# EAGLE design ME433 (EAGLE 9.6.2)
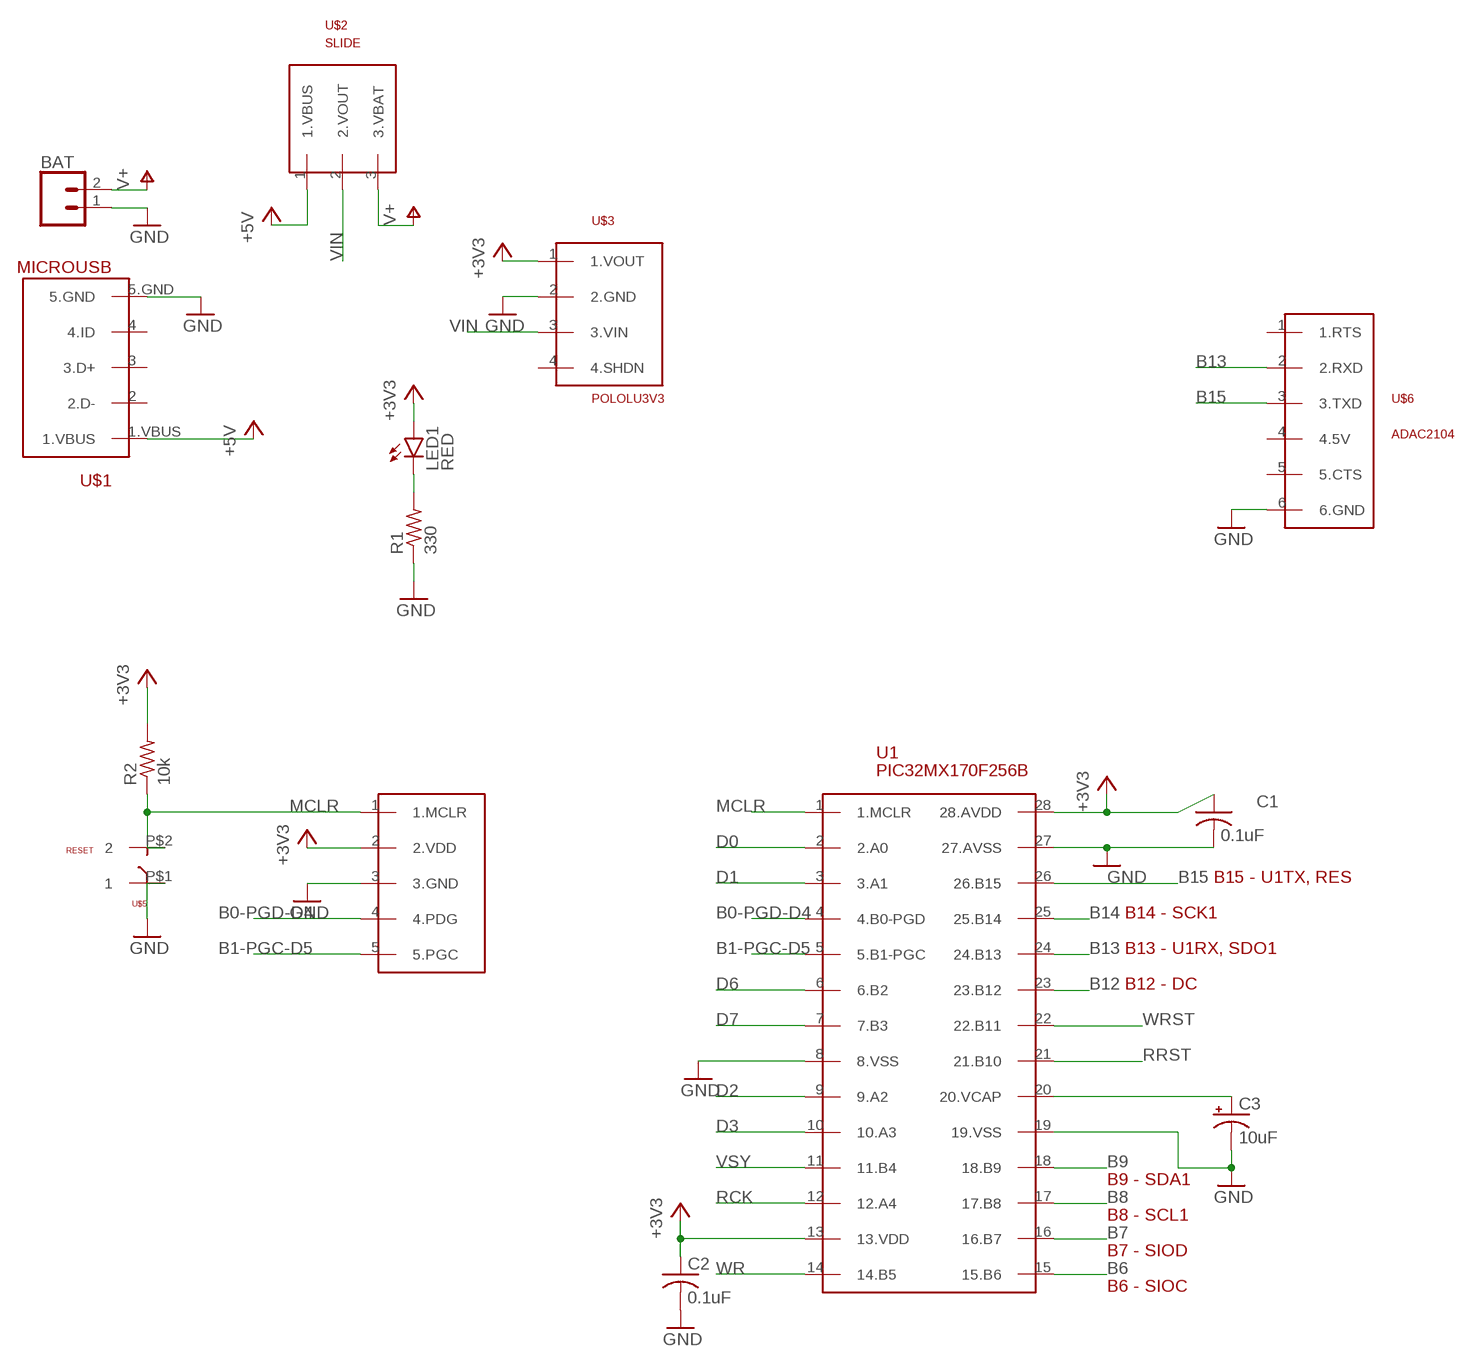
[diagram p0: schematic, sheet 1, part 1 of 2]
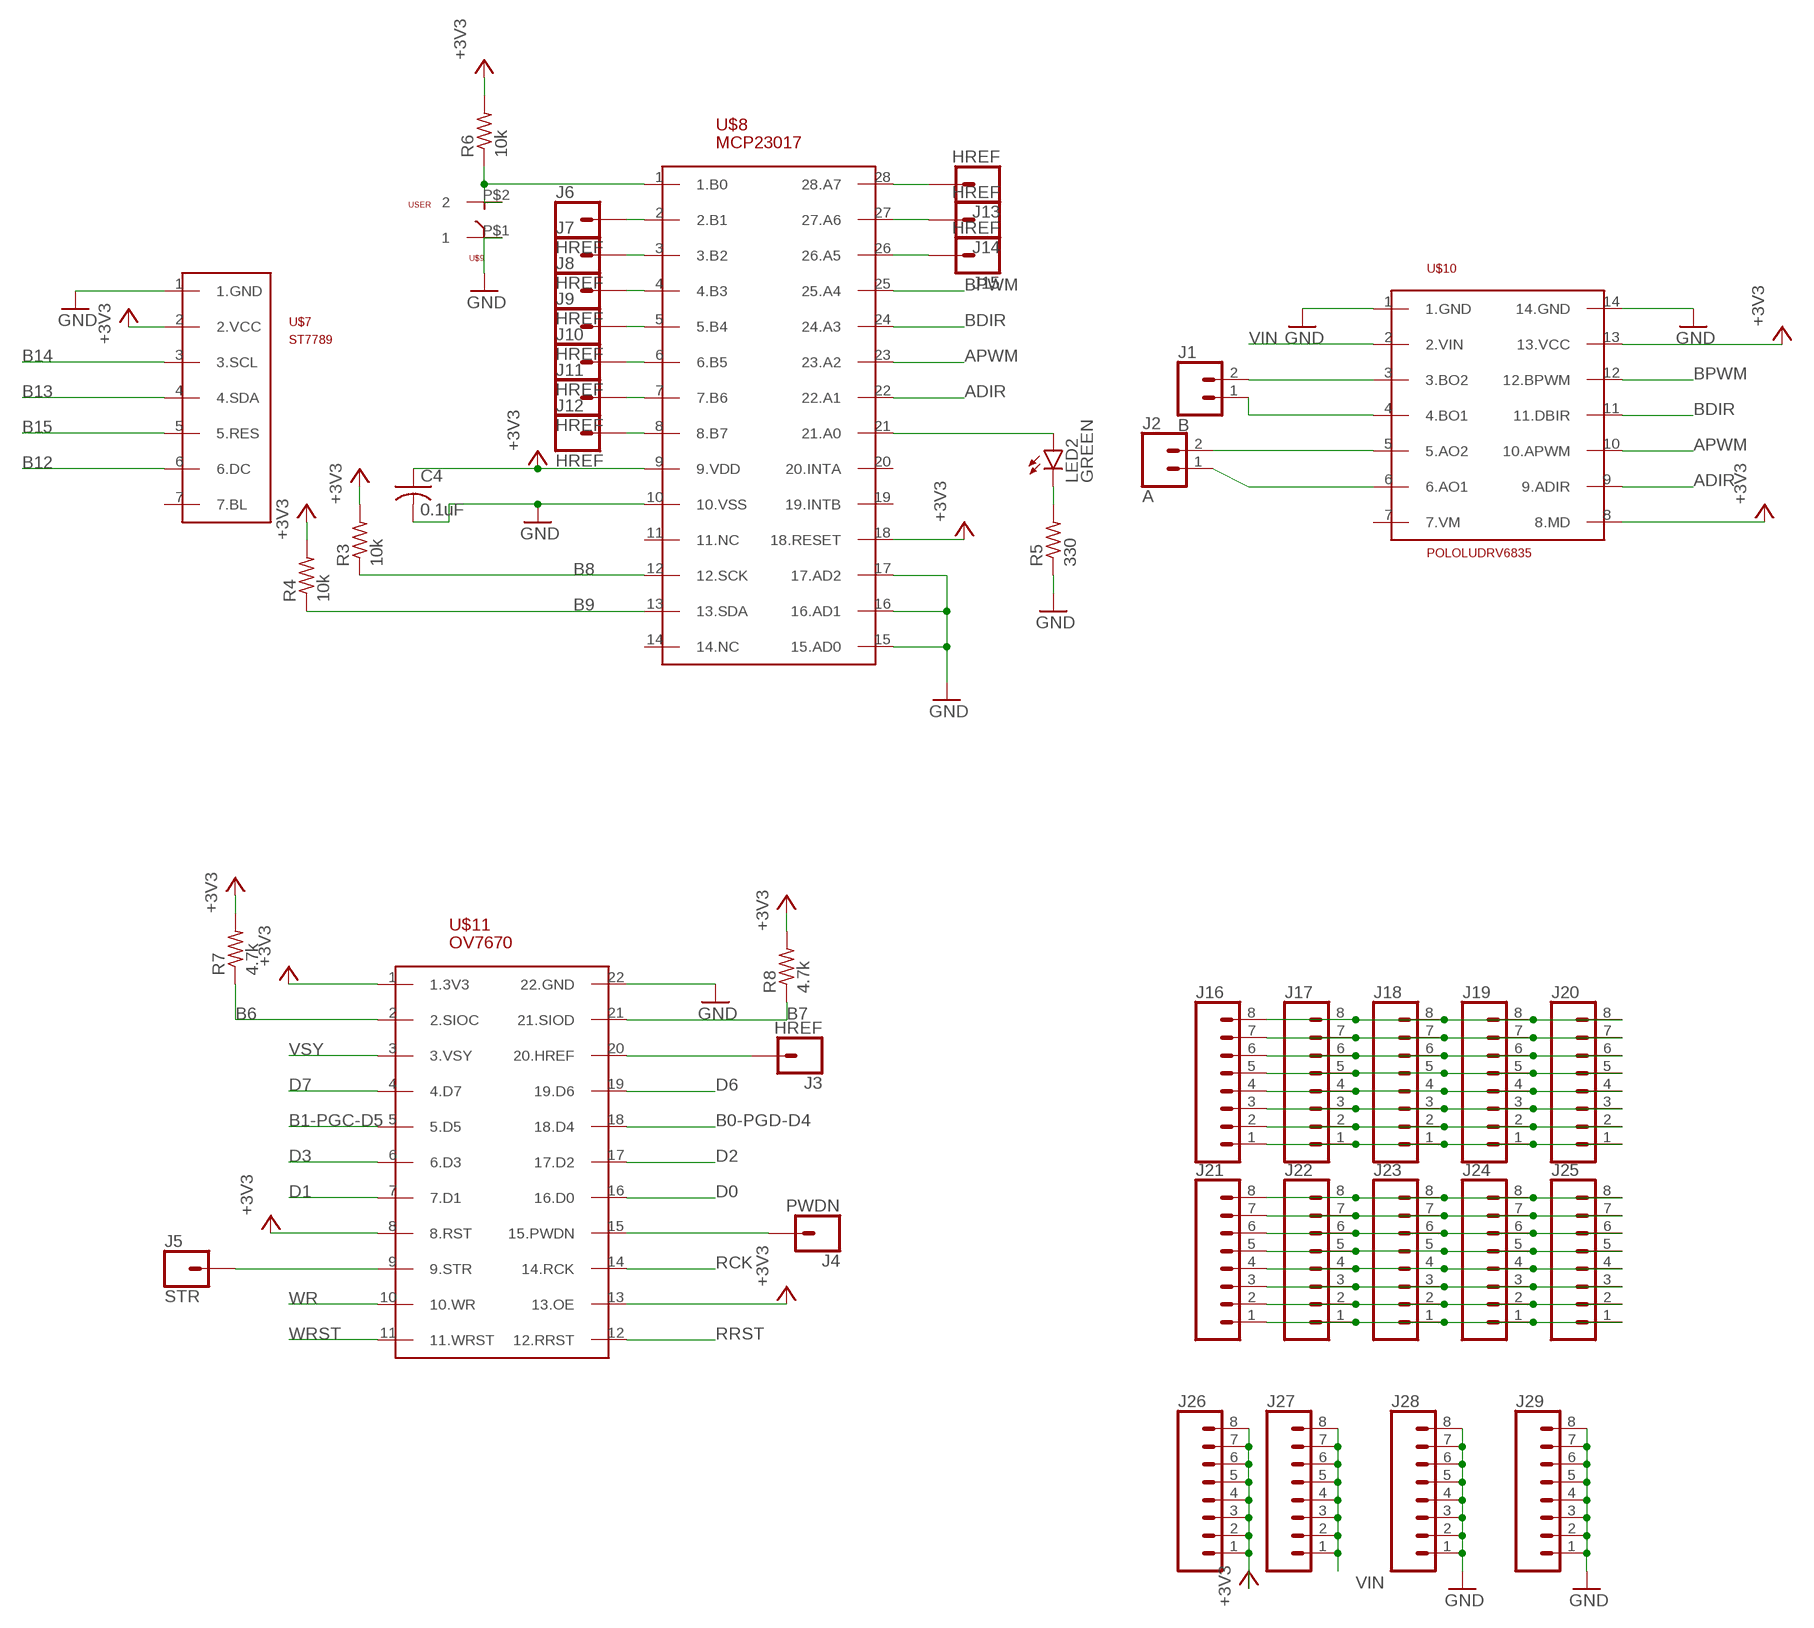
[diagram p1: schematic, sheet 1, part 2 of 2]

## Parts
BAT  CONN_02  [1X02]
C1  0.1uF  C-US025-030X050  [C025-030X050]
C2  0.1uF  C-US025-030X050  [C025-030X050]
C3  10uF  CPOL-USB45181B  [B45181B]
C4  0.1uF  C-US025-030X050  [C025-030X050]
J1  B  CONN_02  [1X02]
J2  A  CONN_02  [1X02]
J3  HREF  CONN_01  [1X01]
J4  PWDN  CONN_01  [1X01]
J5  STR  CONN_01  [1X01]
J6  HREF  CONN_01  [1X01]
J7  HREF  CONN_01  [1X01]
J8  HREF  CONN_01  [1X01]
J9  HREF  CONN_01  [1X01]
J10  HREF  CONN_01  [1X01]
J11  HREF  CONN_01  [1X01]
J12  HREF  CONN_01  [1X01]
J13  HREF  CONN_01  [1X01]
J14  HREF  CONN_01  [1X01]
J15  HREF  CONN_01  [1X01]
J16  CONN_08"  [1X08]
J17  CONN_08"  [1X08]
J18  CONN_08"  [1X08]
J19  CONN_08"  [1X08]
J20  CONN_08"  [1X08]
J21  CONN_08"  [1X08]
J22  CONN_08"  [1X08]
J23  CONN_08"  [1X08]
J24  CONN_08"  [1X08]
J25  CONN_08"  [1X08]
J26  CONN_08"  [1X08]
J27  CONN_08"  [1X08]
J28  CONN_08"  [1X08]
J29  CONN_08"  [1X08]
LED1  RED  LED3MM  [LED3MM]
LED2  GREEN  LED3MM  [LED3MM]
R1  330  R-US_0207/10  [0207/10]
R2  10k  R-US_0207/10  [0207/10]
R3  10k  R-US_0207/10  [0207/10]
R4  10k  R-US_0207/10  [0207/10]
R5  330  R-US_0207/10  [0207/10]
R6  10k  R-US_0207/10  [0207/10]
R7  4.7k  R-US_0207/10  [0207/10]
R8  4.7k  R-US_0207/10  [0207/10]
U1  PIC32MX170F256B  [DIL28-3]
U$1  MICROUSB  [MICROUSB]
U$2  SLIDE  [SLIDE]
U$3  POLOLU3V3  [POLOLU3V3]
U$4  SNAP  [SNAP]
U$5  RESET  PUSH  [PUSH]
U$6  ADAC2104  [ADAC2104]
U$7  ST7789  [ST7789]
U$8  MCP23017  [DIL28-3]
U$9  USER  PUSH  [PUSH]
U$10  POLOLUDRV6835  [POLOLUDRV6835]
U$11  OV7670  [OV7670]

## Nets
+3V3: C1.1 C2.1 C4.1 J26.1 J26.2 J26.3 J26.4 J26.5 J26.6 J26.7 J26.8 LED1.A R2.2 R3.2 R4.2 R6.2 R7.2 R8.2 U1.13(13.VDD) U1.28(28.AVDD) U$3.1(1.VOUT) U$4.2(2.VDD) U$7.2(2.VCC) U$8.9(9.VDD) U$8.18(18.RESET) U$10.8(8.MD) U$10.13(13.VCC) U$11.1(1.3V3) U$11.8(8.RST) U$11.13(13.OE)
+5V: U$1.1.VBUS U$2.1(1.VBUS)
ADIR: U$8.22(22.A1) U$10.9(9.ADIR)
APWM: U$8.23(23.A2) U$10.10(10.APWM)
B0-PGD-D4: U1.4(4.B0-PGD) U$4.4(4.PDG) U$11.18(18.D4)
B1-PGC-D5: U1.5(5.B1-PGC) U$4.5(5.PGC) U$11.5(5.D5)
B6: R7.1 U1.15(15.B6) U$11.2(2.SIOC)
B7: R8.1 U1.16(16.B7) U$11.21(21.SIOD)
B8: R3.1 U1.17(17.B8) U$8.12(12.SCK)
B9: R4.1 U1.18(18.B9) U$8.13(13.SDA)
B12: U1.23(23.B12) U$7.6(6.DC)
B13: U1.24(24.B13) U$6.2(2.RXD) U$7.4(4.SDA)
B14: U1.25(25.B14) U$7.3(3.SCL)
B15: U1.26(26.B15) U$6.3(3.TXD) U$7.5(5.RES)
BDIR: U$8.24(24.A3) U$10.11(11.DBIR)
BPWM: U$8.25(25.A4) U$10.12(12.BPWM)
D0: U1.2(2.A0) U$11.16(16.D0)
D1: U1.3(3.A1) U$11.7(7.D1)
D2: U1.9(9.A2) U$11.17(17.D2)
D3: U1.10(10.A3) U$11.6(6.D3)
D6: U1.6(6.B2) U$11.19(19.D6)
D7: U1.7(7.B3) U$11.4(4.D7)
GND: BAT.1 C1.2 C2.2 C3.- C4.2 J28.1 J28.2 J28.3 J28.4 J28.5 J28.6 J28.7 J28.8 J29.1 J29.2 J29.3 J29.4 J29.5 J29.6 J29.7 J29.8 R1.1 R5.1 U1.8(8.VSS) U1.19(19.VSS) U1.27(27.AVSS) U$1.5.GND U$3.2(2.GND) U$4.3(3.GND) U$5.P$1 U$6.6(6.GND) U$7.1(1.GND) U$8.10(10.VSS) U$8.15(15.AD0) U$8.16(16.AD1) U$8.17(17.AD2) U$9.P$1 U$10.1(1.GND) U$10.14(14.GND) U$11.22(22.GND)
MCLR: R2.1 U1.1(1.MCLR) U$4.1(1.MCLR) U$5.P$2
N$1: LED1.K(C) R1.2
N$2: C3.+ U1.20(20.VCAP)
N$3: LED2.K(C) R5.2
N$4: J1.2 U$10.3(3.BO2)
N$5: J1.1 U$10.4(4.BO1)
N$6: LED2.A U$8.21(21.A0)
N$7: R6.1 U$8.1(1.B0) U$9.P$2
N$8: J2.2 U$10.5(5.AO2)
N$9: J2.1 U$10.6(6.AO1)
N$10: J5.1 U$11.9(9.STR)
N$11: J4.1 U$11.15(15.PWDN)
N$12: J3.1 U$11.20(20.HREF)
N$13: J6.1 U$8.2(2.B1)
N$14: J7.1 U$8.3(3.B2)
N$15: J8.1 U$8.4(4.B3)
N$16: J9.1 U$8.5(5.B4)
N$17: J10.1 U$8.6(6.B5)
N$18: J11.1 U$8.7(7.B6)
N$19: J12.1 U$8.8(8.B7)
N$20: J13.1 U$8.28(28.A7)
N$21: J14.1 U$8.27(27.A6)
N$22: J15.1 U$8.26(26.A5)
N$23: J16.8 J17.8 J18.8 J19.8 J20.8
N$24: J16.7 J17.7 J18.7 J19.7 J20.7
N$25: J16.6 J17.6 J18.6 J19.6 J20.6
N$26: J16.5 J17.5 J18.5 J19.5 J20.5
N$27: J16.4 J17.4 J18.4 J19.4 J20.4
N$28: J16.3 J17.3 J18.3 J19.3 J20.3
N$29: J16.2 J17.2 J18.2 J19.2 J20.2
N$30: J16.1 J17.1 J18.1 J19.1 J20.1
N$31: J21.8 J22.8 J23.8 J24.8 J25.8
N$32: J21.7 J22.7 J23.7 J24.7 J25.7
N$33: J21.6 J22.6 J23.6 J24.6 J25.6
N$34: J21.5 J22.5 J23.5 J24.5 J25.5
N$35: J21.4 J22.4 J23.4 J24.4 J25.4
N$36: J21.3 J22.3 J23.3 J24.3 J25.3
N$37: J21.2 J22.2 J23.2 J24.2 J25.2
N$38: J21.1 J22.1 J23.1 J24.1 J25.1
RCK: U1.12(12.A4) U$11.14(14.RCK)
RRST: U1.21(21.B10) U$11.12(12.RRST)
V+: BAT.2 U$2.3(3.VBAT)
VIN: J27.1 J27.2 J27.3 J27.4 J27.5 J27.6 J27.7 J27.8 U$2.2(2.VOUT) U$3.3(3.VIN) U$10.2(2.VIN)
VSY: U1.11(11.B4) U$11.3(3.VSY)
WR: U1.14(14.B5) U$11.10(10.WR)
WRST: U1.22(22.B11) U$11.11(11.WRST)
Unconnected: U$1.2(2.D-) U$1.3(3.D+) U$1.4(4.ID) U$3.4(4.SHDN) U$6.1(1.RTS) U$6.4(4.5V) U$6.5(5.CTS) U$7.7(7.BL) U$8.11(11.NC) U$8.14(14.NC) U$8.19(19.INTB) U$8.20(20.INTA) U$10.7(7.VM)

## Notes on the sheet
- B15 - U1TX, RES
- B14 - SCK1
- B13 - U1RX, SDO1
- B12 - DC
- B9 - SDA1
- B8 - SCL1
- B7 - SIOD
- B6 - SIOC

## Library data of the parts
BAT J1 J2 = ME433:CONN_02: Multi connection point. Often used as Generic Header-pin footprint for 0.1 inch spaced/style header connections On any of the 0.1 inch spaced packages, you can populate with these: Break Away Headers - Straight <https://www.sparkfun.com/products/116> (PRT-00116) Break Away Male Headers - Right Angle <https://www.sparkfun.com/products/553> (PRT-00553) Female Headers <https://www.sparkfun.com/products/115> (PRT-00115) Break Away Headers - Machine Pin <https://www.sparkfun.com/products/117> (PRT-00117) Break Away Female Headers - Swiss Machine Pin <https://www.sparkfun.com/products/743> (PRT-00743) For SCREWTERMINALS and SPRING TERMINALS visit here: Screw Terimnals on SparkFun.com <https://www.sparkfun.com/search/results?term=Screw+Terminals> (5mm/3.5mm/2.54mm spacing) This device is also useful as a general connection point to wire up your design to another part of your project. Our various solder wires solder well into these plated through hole pads. Hook-Up Wire - Assortment (Stranded, 22 AWG) <https://www.sparkfun.com/products/11375> (PRT-11375) Hook-Up Wire - Assortment (Solid Core, 22 AWG) <https://www.sparkfun.com/products/11367> (PRT-11367) View the entire wire category on our website here <https://www.sparkfun.com/categories/141> Special notes: Molex polarized connector foot print use with: PRT-08233 with associated crimp pins and housings. 2.54_SCREWTERM for use with PRT-10571. 3.5mm Screw Terminal footprints for PRT-08084 5mm Screw Terminal footprints for use with PRT-08432
C1 C2 C4 = ME433:C-US: CAPACITOR, American symbol; SPICEPREFIX: C
C3 = ME433:CPOL-US: POLARIZED CAPACITOR, American symbol; SPICEPREFIX: C
J3-J15 = ME433:CONN_01: Single connection point. Often used as Generic Header-pin footprint for 0.1 inch spaced/style header connections On any of the 0.1 inch spaced packages, you can populate with these: Break Away Headers - Straight <https://www.sparkfun.com/products/116> (PRT-00116) Break Away Male Headers - Right Angle <https://www.sparkfun.com/products/553> (PRT-00553) Female Headers <https://www.sparkfun.com/products/115> (PRT-00115) Break Away Headers - Machine Pin <https://www.sparkfun.com/products/117> (PRT-00117) Break Away Female Headers - Swiss Machine Pin <https://www.sparkfun.com/products/743> (PRT-00743) This device is also useful as a general connection point to wire up your design to another part of your project. Our various solder wires solder well into these plated through hole pads. Hook-Up Wire - Assortment (Stranded, 22 AWG) <https://www.sparkfun.com/products/11375> (PRT-11375) Hook-Up Wire - Assortment (Solid Core, 22 AWG) <https://www.sparkfun.com/products/11367> (PRT-11367) View the entire wire category on our website here <https://www.sparkfun.com/categories/141> Special notes: SMTSO-256-ET is a "flush mount" nut for a 4-40 screw. We mostly use this on specialty testbeds; it is a nice way to connect hardware to your PCB at an adjustable hieght. Also note, the SNAP packages are for using a snappable style connector. We sell a baggie of snaps and they are also used on two LilyPad designs: Snap Assortment - 30 pack (male and female) <https://www.sparkfun.com/products/11347> (DEV-11347) LilyPad Arduino SimpleSnap <https://www.sparkfun.com/products/10941> (DEV-10941) LilyPad SimpleSnap Protoboard <https://www.sparkfun.com/products/10940> (DEV-10940)
J16-J29 = ME433:CONN_08: Multi connection point. Often used as Generic Header-pin footprint for 0.1 inch spaced/style header connections On any of the 0.1 inch spaced packages, you can populate with these: Break Away Headers - Straight <https://www.sparkfun.com/products/116> (PRT-00116) Break Away Male Headers - Right Angle <https://www.sparkfun.com/products/553> (PRT-00553) Female Headers <https://www.sparkfun.com/products/115> (PRT-00115) Break Away Headers - Machine Pin <https://www.sparkfun.com/products/117> (PRT-00117) Break Away Female Headers - Swiss Machine Pin <https://www.sparkfun.com/products/743> (PRT-00743) Arduino Stackable Header - 8 Pin <https://www.sparkfun.com/products/9279> (PRT-09279) For SCREWTERMINALS and SPRING TERMINALS visit here: Screw Terimnals on SparkFun.com <https://www.sparkfun.com/search/results?term=Screw+Terminals> (5mm/3.5mm/2.54mm spacing) This device is also useful as a general connection point to wire up your design to another part of your project. Our various solder wires solder well into these plated through hole pads. Hook-Up Wire - Assortment (Stranded, 22 AWG) <https://www.sparkfun.com/products/11375> (PRT-11375) Hook-Up Wire - Assortment (Solid Core, 22 AWG) <https://www.sparkfun.com/products/11367> (PRT-11367) View the entire wire category on our website here <https://www.sparkfun.com/categories/141> Special notes: Molex polarized connector foot print use with SKU : PRT-08231 with associated crimp pins and housings. 1MM SMD Version SKU: PRT-10208 NOTES ON THE VARIANTS LOCK and LOCK_LONGPADS... This footprint was designed to help hold the alignment of a through-hole component (i.e. 6-pin header) while soldering it into place. You may notice that each hole has been shifted either up or down by 0.005 of an inch from it's more standard position (which is a perfectly straight line). This slight alteration caused the pins (the squares in the middle) to touch the edges of the holes. Because they are alternating, it causes a "brace" to hold the component in place. 0.005 has proven to be the perfect amount of "off-center" position when using our standard breakaway headers. Although looks a little odd when you look at the bare footprint, once you have a header in there, the alteration is very hard to notice. Also,if you push a header all the way into place, it is covered up entirely on the bottom side.; PROD_ID: CONN-08438
LED1 LED2 = ME433:LED: LED OSRAM: - CHIPLED LG R971, LG N971, LY N971, LG Q971, LY Q971, LO R971, LY R971 LH N974, LH R974 LS Q976, LO Q976, LY Q976 LO Q996 - Hyper CHIPLED LW Q18S LB Q993, LB Q99A, LB R99A - SideLED LS A670, LO A670, LY A670, LG A670, LP A670 LB A673, LV A673, LT A673, LW A673 LH A674 LY A675 LS A676, LA A676, LO A676, LY A676, LW A676 LS A679, LY A679, LG A679 - Hyper Micro SIDELED® LS Y876, LA Y876, LO Y876, LY Y876 LT Y87S - SmartLED LW L88C, LW L88S LB L89C, LB L89S, LG L890 LS L89K, LO L89K, LY L89K LS L896, LA L896, LO L896, LY L896 - TOPLED LS T670, LO T670, LY T670, LG T670, LP T670 LSG T670, LSP T670, LSY T670, LOP T670, LYG T670 LG T671, LOG T671, LSG T671 LB T673, LV T673, LT T673, LW T673 LH T674 LS T676, LA T676, LO T676, LY T676, LB T676, LH T676, LSB T676, LW T676 LB T67C, LV T67C, LT T67C, LS T67K, LO T67K, LY T67K, LW E67C LS E67B, LA E67B, LO E67B, LY E67B, LB E67C, LV E67C, LT E67C LW T67C LS T679, LY T679, LG T679 LS T770, LO T770, LY T770, LG T770, LP T770 LB T773, LV T773, LT T773, LW T773 LH T774 LS E675, LA E675, LY E675, LS T675 LS T776, LA T776, LO T776, LY T776, LB T776 LHGB T686 LT T68C, LB T68C - Hyper Mini TOPLED® LB M676 - Mini TOPLED Santana® LG M470 LS M47K, LO M47K, LY M47K Source: http://www.osram.convergy.de LUXEON: - LUMILED® LXK2-PW12-R00, LXK2-PW12-S00, LXK2-PW14-U00, LXK2-PW14-V00 LXK2-PM12-R00, LXK2-PM12-S00, LXK2-PM14-U00 LXK2-PE12-Q00, LXK2-PE12-R00, LXK2-PE12-S00, LXK2-PE14-T00, LXK2-PE14-U00 LXK2-PB12-K00, LXK2-PB12-L00, LXK2-PB12-M00, LXK2-PB14-N00, LXK2-PB14-P00, LXK2-PB14-Q00 LXK2-PR12-L00, LXK2-PR12-M00, LXK2-PR14-Q00, LXK2-PR14-R00 LXK2-PD12-Q00, LXK2-PD12-R00, LXK2-PD12-S00 LXK2-PH12-R00, LXK2-PH12-S00 LXK2-PL12-P00, LXK2-PL12-Q00, LXK2-PL12-R00 Source: www.luxeon.com KINGBRIGHT: KA-3528ASYC Source: www.kingbright.com
R1-R8 = ME433:R-US_: RESISTOR, American symbol; SPICEPREFIX: R
U1 = ME433_HW6:PIC32MX170F256B
U$1 = ME433:MICROUSB
U$2 = ME433:SLIDE
U$3 = ME433:POLOLU3V3
U$4 = ME433:SNAP
U$5 U$9 = ME433:PUSH
U$6 = ME433:ADAC2104
U$7 = ME433:ST7789
U$8 = ME433:MCP23017
U$10 = ME433:POLOLUDRV6835
U$11 = ME433:OV7670

## Board
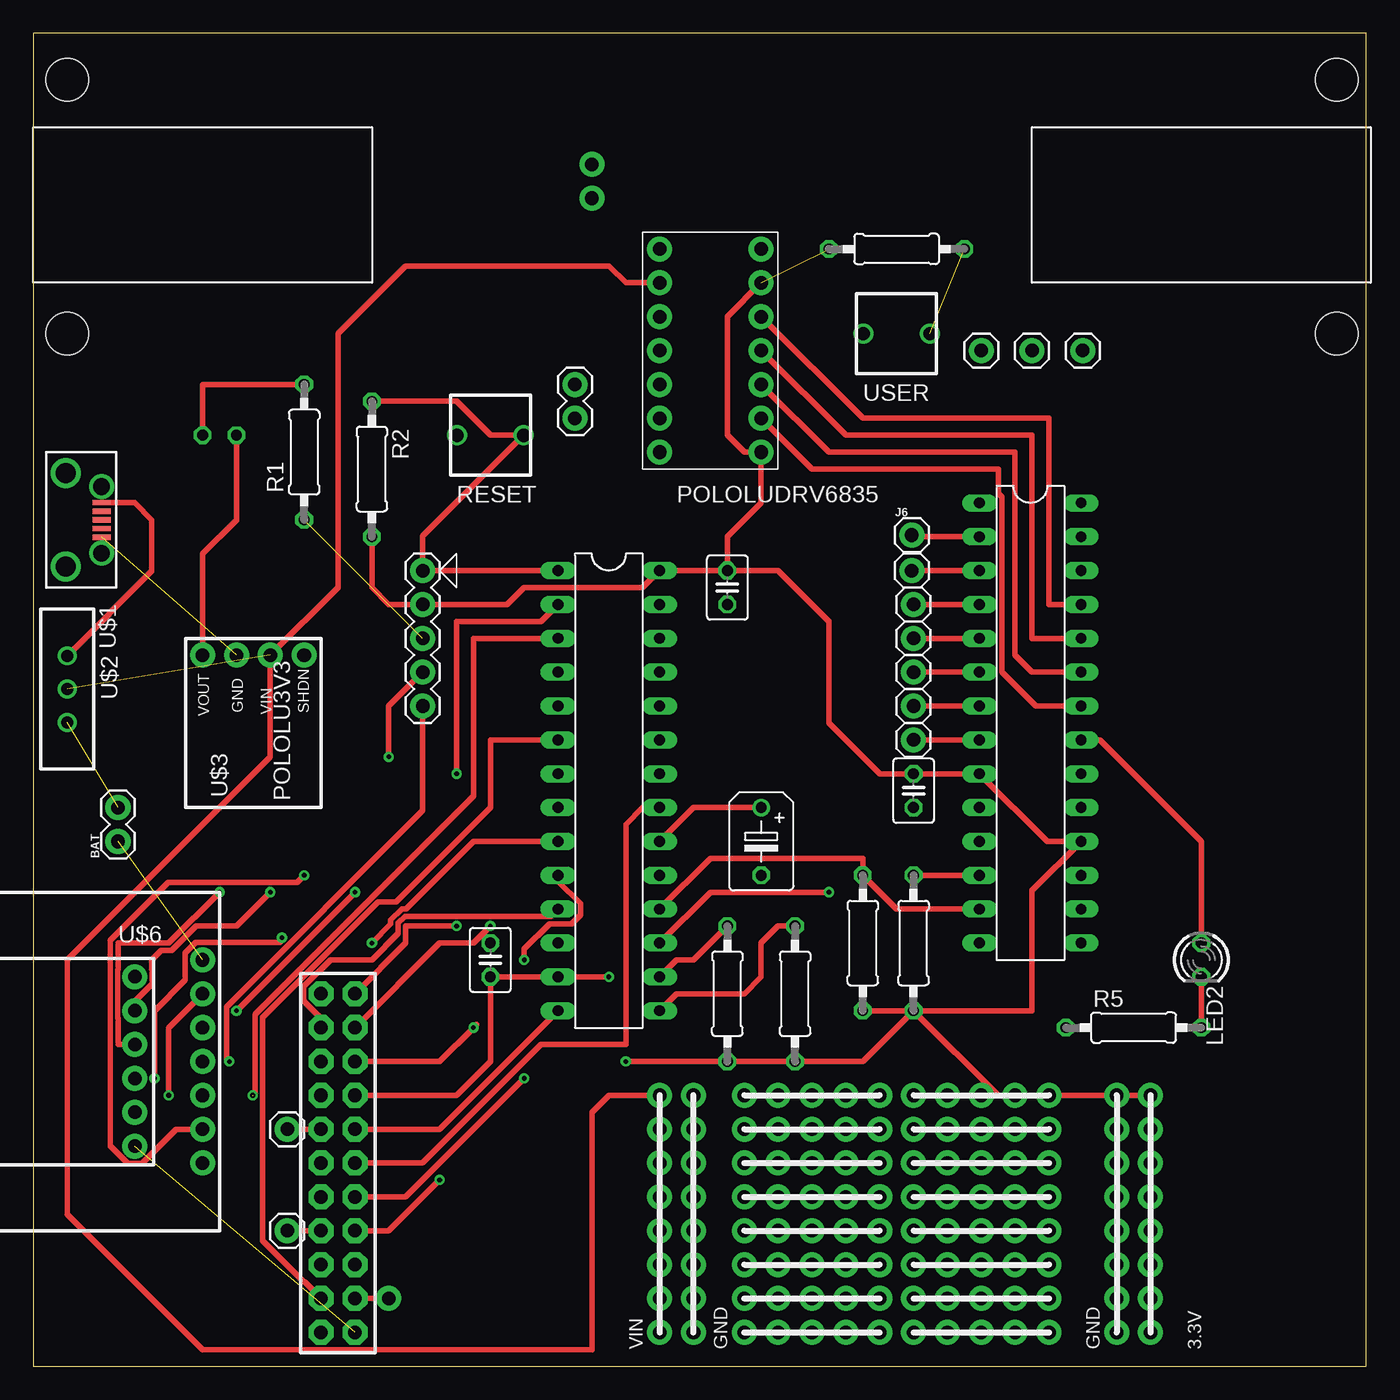
[diagram p2: board, top side]
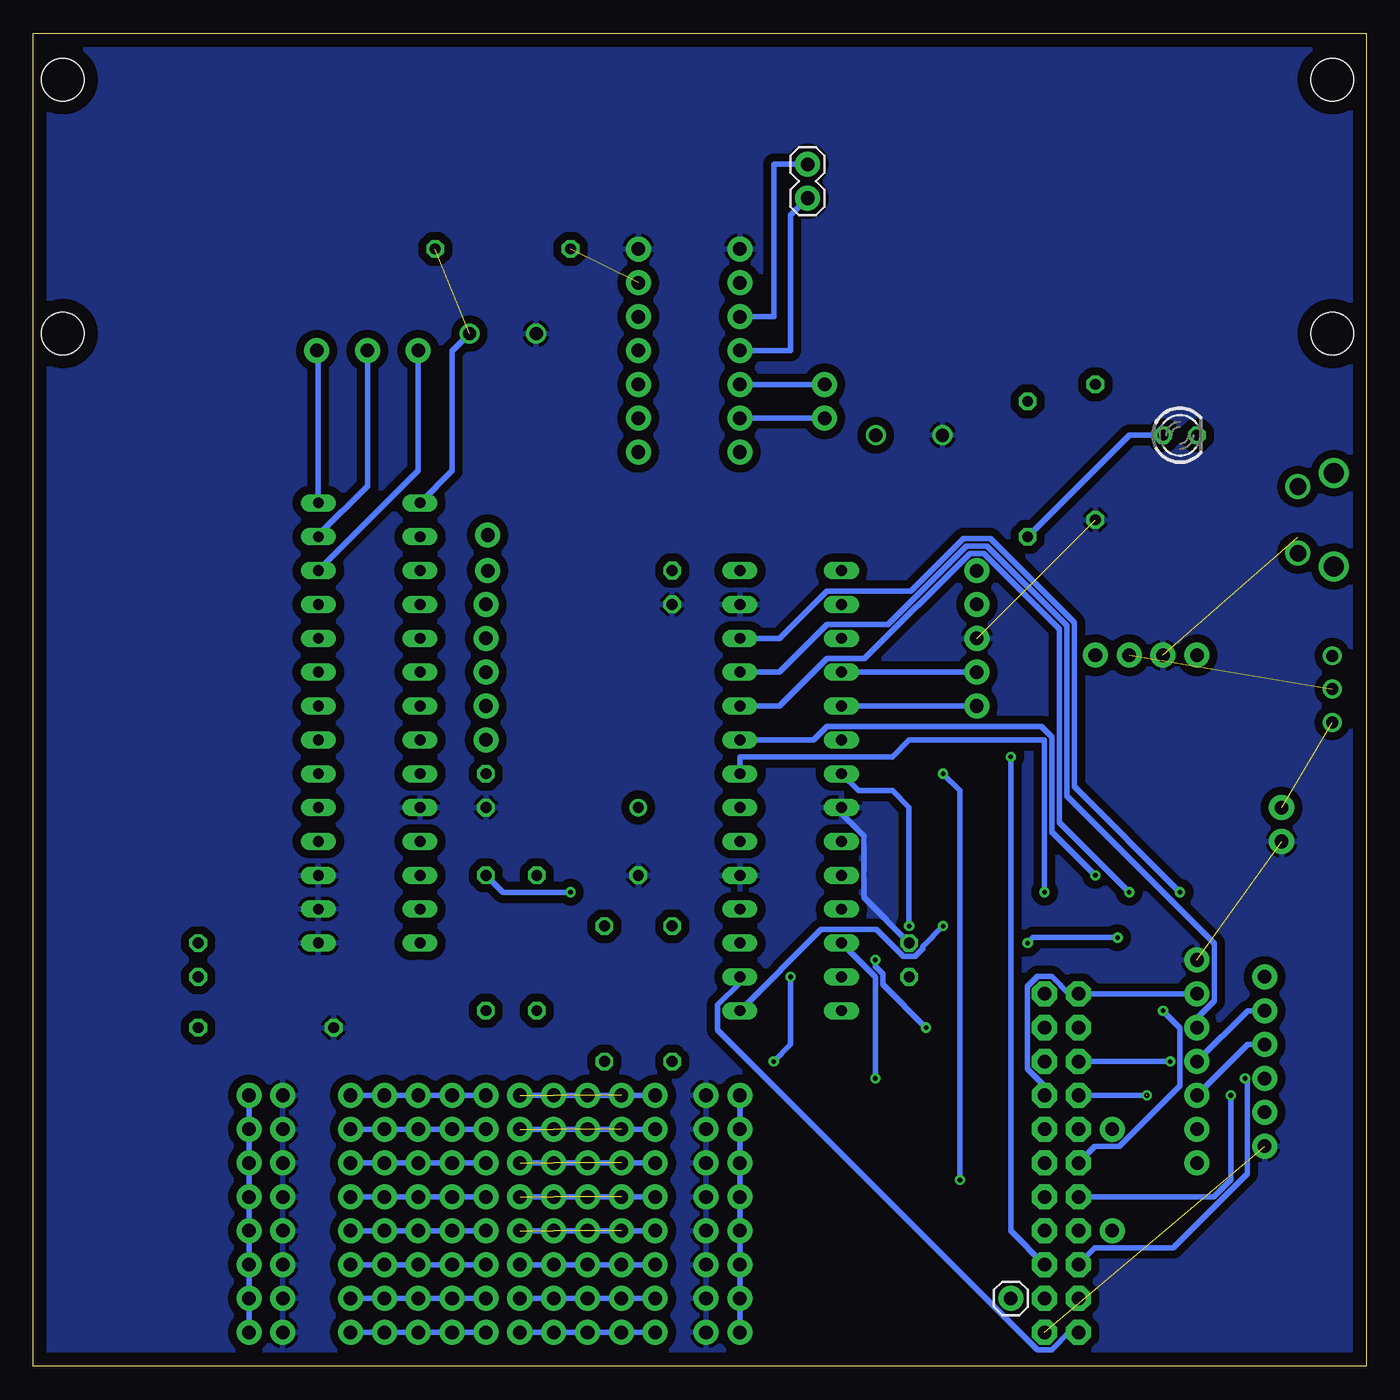
[diagram p3: board, bottom side, seen from below]

Size 100 x 100 mm. Coordinates in mm from the lower left corner, seen from the top.
Outline: 0,0 100,0 100,100 0,100 0,0
Copper layers (1*16): Top 0.035mm / dielectric 1.5mm / Bottom 0.035mm
Design rules "default": minimum track width 6mil, minimum drill 0.35mm, track to track 6mil, track to pad 6mil, pad to pad 6mil, via to via 6mil, smd to smd 6mil, copper to edge 40mil, drill to drill 6mil, minimum pad ring 10mil, minimum via ring 8mil, stop-mask expansion 4mil, vias tented up to drill 0mil, thermal gap 10mil
Holes 3.17 mm at 2.54,96.52 2.54,77.47 97.79,96.52 97.79,77.47

### Footprints (pad centres in the part's own frame; a part is rotated, then mirrored left to right if it is on the bottom)
1X02 = drill 1.016 pad 1.88: 1 0,0; 2 2.54,0
C025-030X050 = drill 0.813 octagon: 1 -1.27,0; 2 1.27,0
B45181B = drill 0.813: + -2.54,0 | drill 0.813 octagon: - 2.54,0
1X01 = drill 1.016 pad 1.88: 1 0,0
1X08 = drill 1.016 pad 1.88: 1 0,0; 2 2.54,0; 3 5.08,0; 4 7.62,0; 5 10.16,0; 6 12.7,0; 7 15.24,0; 8 17.78,0
LED3MM = drill 0.813 octagon: A -1.27,0; K 1.27,0
0207/10 = drill 0.813 octagon: 1 -5.08,0; 2 5.08,0
DIL28-3 = drill 0.813 long: 1 -16.51,-3.81; 2 -13.97,-3.81; 3 -11.43,-3.81; 4 -8.89,-3.81; 5 -6.35,-3.81; 6 -3.81,-3.81; 7 -1.27,-3.81; 8 1.27,-3.81; 9 3.81,-3.81; 10 6.35,-3.81; 11 8.89,-3.81; 12 11.43,-3.81; 13 13.97,-3.81; 14 16.51,-3.81; 15 16.51,3.81; 16 13.97,3.81; 17 11.43,3.81; 18 8.89,3.81; 19 6.35,3.81; 20 3.81,3.81; 21 1.27,3.81; 22 -1.27,3.81; 23 -3.81,3.81; 24 -6.35,3.81; 25 -8.89,3.81; 26 -11.43,3.81; 27 -13.97,3.81; 28 -16.51,3.81
MICROUSB = smd 0.4 x 1.35: 1.VBUS -1.3,2.7; 2 -0.65,2.7; 3 0,2.7; 4 0.65,2.7; 5.GND 1.3,2.7 | drill 1.25 pad 1.676: P$1 -2.5,2.7; P$7 2.5,2.7 | drill 1.5: P$8 3.5,0; P$9 -3.5,0
SLIDE = drill 0.9: 1 -2.5,0; 2 0,0; 3 2.5,0
POLOLU3V3 = drill 1.016 pad 1.88: 1 0,3.81; 2 0,1.27; 3 0,-1.27; 4 0,-3.81
SNAP = drill 1.016 pad 1.88: 1 0,5.08; 2 0,2.54; 3 0,0; 4 0,-2.54; 5 0,-5.08
PUSH = drill 1: P$1 -2.5,0; P$2 2.5,0
ADAC2104 = drill 1.016 pad 1.88: 1 0,6.35; 2 0,3.81; 3 0,1.27; 4 0,-1.27; 5 0,-3.81; 6 0,-6.35
ST7789 = drill 1.016 pad 1.88: 1 3.81,7.62; 2 3.81,5.08; 3 3.81,2.54; 4 3.81,0; 5 3.81,-2.54; 6 3.81,-5.08; 7 3.81,-7.62
POLOLUDRV6835 = drill 1.016 pad 1.88: 1 -3.81,7.62; 2 -3.81,5.08; 3 -3.81,2.54; 4 -3.81,0; 5 -3.81,-2.54; 6 -3.81,-5.08; 7 -3.81,-7.62; 8 3.81,-7.62; 9 3.81,-5.08; 10 3.81,-2.54; 11 3.81,0; 12 3.81,2.54; 13 3.81,5.08; 14 3.81,7.62
OV7670 = drill 1.016 pad 1.88 octagon: 1 -1.27,12.7; 2 1.27,12.7; 3 -1.27,10.16; 4 1.27,10.16; 5 -1.27,7.62; 6 1.27,7.62; 7 -1.27,5.08; 8 1.27,5.08; 9 -1.27,2.54; 10 1.27,2.54; 11 -1.27,0; 12 1.27,0; 13 -1.27,-2.54; 14 1.27,-2.54; 15 -1.27,-5.08; 16 1.27,-5.08; 17 -1.27,-7.62; 18 1.27,-7.62; 19 -1.27,-10.16; 20 1.27,-10.16; 21 -1.27,-12.7; 22 1.27,-12.7

### Placement (x,y rotation side)
BAT  6.35,39.37 90 top
C1  52.07,58.42 270 top
C2  34.29,30.48 90 top
C3  54.61,39.37 270 top
C4  66.04,43.18 270 top
J1  41.91,87.63 90 bottom
J2  40.64,71.12 90 top
J3  26.67,5.08 0 bottom
J4  19.05,10.16 0 top
J5  19.05,17.78 0 top
J6  65.91,62.36 0 top
J7  65.91,59.69 0 top
J8  66.04,57.15 0 top
J9  66.04,54.61 0 top
J10  66.04,52.07 0 top
J11  66.04,49.53 0 top
J12  66.04,46.99 0 top
J13  78.74,76.2 0 top
J14  74.93,76.2 0 top
J15  71.12,76.2 0 top
J16  53.34,2.54 90 top
J17  55.88,2.54 90 top
J18  58.42,2.54 90 top
J19  60.96,2.54 90 top
J20  63.5,2.54 90 top
J21  66.04,2.54 90 top
J22  68.58,2.54 90 top
J23  71.12,2.54 90 top
J24  73.66,2.54 90 top
J25  76.2,2.54 90 top
J26  83.82,2.54 90 top
J27  46.99,2.54 90 top
J28  49.53,2.54 90 top
J29  81.28,2.54 90 top
LED1  13.97,69.85 0 bottom
LED2  87.63,30.48 270 top
R1  20.32,68.58 90 top
R2  25.4,67.31 270 top
R3  66.04,31.75 270 top
R4  62.23,31.75 270 top
R5  82.55,25.4 0 top
R6  64.77,83.82 180 top
R7  57.15,27.94 270 top
R8  52.07,27.94 270 top
U1  43.18,43.18 270 top
U$1  2.41,63.5 270 top
U$2  2.54,50.8 270 top
U$3  16.51,53.34 90 top
U$4  29.21,54.61 0 top
U$5  34.29,69.85 0 top
U$6  7.62,22.86 0 top
U$7  8.89,22.86 0 top
U$8  74.8,48.26 270 top
U$9  64.77,77.47 0 top
U$10  50.8,76.2 0 top
U$11  22.86,15.24 0 top

### Tracks (layer width: path | path; a pad name or v marks a point on that pad's centre or on a via)
+3V3  (via drill 0.35)  (1 unrouted)
  Top 0.406: C1.1 U1.28 45.72,58.42 36.83,58.42 35.56,57.15 U$4.2 26.67,57.15 25.4,58.42 R2.2 | C1.1 52.07,62.23 54.61,64.77 U$10.8 53.34,68.58 52.07,69.85 52.07,78.74 U$10.13 | C1.1 55.88,59.69 59.69,55.88 59.69,48.26 63.5,44.45 C4.1 U$8.9 76.07,39.37 U$8.18 74.93,35.69 74.93,26.67 R3.2 | R3.2 R4.2 | R3.2 62.23,22.86 R7.2 R8.2 v44.45,22.86 | v43.18,29.21 U1.13 C2.1 34.29,22.86 31.75,20.32 U$11.8 | U$3.1 12.7,60.96 15.24,63.5 LED1.A | R3.2 72.39,20.32 J26.8 | v10.16,20.32 10.16,25.4 U$7.2
  Bottom 0.406: LED1.A 17.78,69.85 R2.2 | v44.45,22.86 43.18,24.13 v43.18,29.21 | U$7.2 U$11.1 22.3,27.94 23.59,29.23 24.67,29.23 25.43,28.48 25.43,22.32 24.13,21.03 U$11.8 | J26.8 J26.7 J26.6 J26.5 J26.4 J26.3 J26.2 J26.1 | U$11.13 11.43,12.7 10.16,13.97 v10.16,20.32
+5V
  Top 0.406: U$1.1.VBUS 7.59,64.8 8.89,63.5 8.89,59.65 U$2.1
ADIR
  Top 0.406: U$8.22 75.21,49.53 72.67,52.07 72.67,65.19 72.39,65.47 72.39,67.31 58.42,67.31 U$10.9
APWM
  Top 0.406: U$10.10 59.69,68.58 73.66,68.58 73.66,53.34 74.93,52.07 U$8.23
B0-PGD-D4  (via drill 0.35)
  Top 0.406: U$4.4 26.67,49.53 v26.67,45.72
  Bottom 0.406: U$4.4 U1.4 | U$11.18 26.67,10.16 v26.67,45.72
B1-PGC-D5  (via drill 0.35)
  Top 0.406: U$4.5 29.21,41.68 14.51,26.97 14.51,22.86 v14.7,22.86
  Bottom 0.406: U$4.5 U1.5 | v14.7,22.86 U$11.5
B6  (via drill 0.35)
  Top 0.406: U1.15 48.26,27.94 53.34,27.94 54.61,29.21 54.61,31.75 55.88,33.02 R7.1 | U$11.2 27.94,31.75 27.94,33.02 v31.75,33.02
  Bottom 0.406: v31.75,33.02 33.27,31.5 33.27,31.33 33.87,30.73 34.71,30.73 36.74,32.77 40.89,32.77 U1.15
  other vias: 24.13,27.94
B7
  Top 0.406: U1.16 48.26,30.48 49.53,30.48 R8.1
  Bottom 0.406: U1.16 46.99,28.77 48.67,27.09 48.67,25.24 24.67,1.25 23.59,1.25 22.3,2.54 U$11.21
B8  (via drill 0.35)
  Top 0.406: U$8.12 R3.1 | U1.17 50.8,35.56 v59.69,35.56
  Bottom 0.406: v59.69,35.56 64.77,35.56 R3.1
B9
  Top 0.406: U$8.13 64.77,34.29 R4.1 62.23,38.1 50.8,38.1 U1.18
B12  (via drill 0.35)
  Top 0.406: U$7.6 10.72,17.78 8.16,15.21 7.08,15.21 5.77,16.53 5.77,31.96 10.1,36.29 19.78,36.29 v20.32,36.83
  Bottom 0.406: U1.23 41.47,46.99 40.45,48.01 24.36,48.01 23.57,47.22 23.57,40.08 v20.32,36.83
B13  (via drill 0.35)
  Top 0.406: U$6.2 7.62,27.38 8.91,28.67 8.91,29.75 8.89,29.77 8.89,30.48 9.6,31.19 10.39,31.19 12.22,33.02 15.24,33.02 v17.78,35.56
  Bottom 0.406: U$6.2 8.89,26.67 U$7.4 | v17.78,35.56 23.01,40.79 23.01,55.32 28.67,60.98 29.75,60.98 37.65,53.09 40.45,53.09 44.01,49.53 U1.24
B14
  Bottom 0.406: U1.25 44.01,52.07 40.45,55.63 35.9,55.63 29.98,61.54 28.44,61.54 22.45,55.56 22.45,42.77 11.4,31.73 11.4,27.4 12.7,26.11 U$7.3
B15  (via drill 0.35)
  Top 0.406: v13.97,35.56 10.16,31.75 6.35,31.75 6.35,29.77 6.33,29.75 6.33,26.13 6.35,26.11 6.35,24.13 U$6.3
  Bottom 0.406: U$6.3 8.89,24.13 U$7.5 | v13.97,35.56 21.89,43.48 21.89,55.79 28.21,62.1 30.21,62.1 34.15,58.17 40.45,58.17 44.01,54.61 U1.26
BDIR
  Top 0.406: U$8.24 74.93,54.61 74.93,69.85 60.96,69.85 U$10.11
BPWM
  Top 0.406: U$8.25 76.2,57.15 76.2,71.12 62.23,71.12 U$10.12
D0  (via drill 0.35)
  Top 0.406: U1.2 38.1,55.88 31.75,55.88 v31.75,44.45 | v30.48,13.97 26.67,10.16 U$11.16
  Bottom 0.406: v31.75,44.45 30.48,43.18 v30.48,13.97
  other vias: 24.13,10.16
D1  (via drill 0.35)  (1 unrouted)
  Top 0.406: U1.3 33.02,54.61 33.02,42.78 16.64,26.4 16.64,20.45 16.51,20.32
  Bottom 0.406: U$11.7 v16.46,20.32
D2  (via drill 0.35)
  Top 0.406: U1.9 33.02,39.37 27.96,34.31 27.65,34.31 26.82,33.48 26.82,33.17 v25.4,31.75 | v9.09,21.59 9.09,26.67 | 9.09,26.67 9.09,26.87 | 9.09,26.67 11.4,28.98 11.4,31.02 12.16,31.77 18.52,31.77 18.77,32.03 v18.65,32.15
  Bottom 0.406: U$11.17 20.34,8.87 14.47,8.87 8.91,14.42 8.91,21.59 v9.09,21.59 | v18.65,32.15 25,32.15 v25.4,31.75
D3  (via drill 0.35)
  Top 0.406: U$11.6 30.48,22.86 v33.02,25.4 33.27,25.65 | v36.83,30.48 36.83,31.31 38.72,33.2 40.37,33.2 41.05,33.87 41.05,34.71 39.37,36.39 U1.10
  Bottom 0.406: v36.83,30.48 36.83,30 36.27,29.44 36.27,28.65 v33.02,25.4
D6
  Top 0.406: U1.6 34.29,46.99 34.29,41.91 27.23,34.85 25.88,34.85 17.2,26.17 17.2,9.39 20.26,6.33 20.34,6.33 U$11.19
D7  (via drill 0.35)
  Top 0.406: U$11.4 30.48,31.75 33.02,31.75 v34.29,33.02
  Bottom 0.406: v34.29,33.02 34.29,41.91 35.56,43.18 38.1,43.18 U1.7
GND  (4 unrouted)
  Bottom 0.406: U1.8 39.37,41.47 37.69,39.79 37.69,35.15 C2.2
  pour Bottom (isolate 0.61): 0,0 100.33,0 100.33,100.33 0,100.33
MCLR
  Top 0.406: U1.1 U$4.1 29.21,62.27 U$5.P$2 34.29,69.85 31.75,72.39 R2.1
N$1
  Top 0.406: LED1.K 12.7,73.66 R1.2
N$2
  Top 0.406: U1.20 49.53,41.91 C3.+
N$3
  Top 0.406: LED2.K R5.2
N$4
  Bottom 0.406: U$10.3 44.45,78.74 44.45,90.17 J1.2
N$5
  Bottom 0.406: J1.1 43.18,86.36 43.18,76.2 U$10.4
N$6
  Top 0.406: LED2.A 87.63,39.37 80.01,46.99 U$8.21
N$7  (1 unrouted)
  Bottom 0.406: U$8.1 68.58,67.18 68.58,76.16 U$9.P$2
N$8
  Bottom 0.406: U$10.5 J2.2
N$9
  Bottom 0.406: U$10.6 J2.1
N$10
  Top 0.406: J5.1 U$11.9
N$11
  Top 0.406: J4.1 U$11.15
N$12
  Top 0.406: J3.1 U$11.20
N$13
  Top 0.406: U$8.2 66.04,62.23 J6.1
N$14
  Top 0.406: U$8.3 J7.1
N$15
  Top 0.406: U$8.4 J8.1
N$16
  Top 0.406: J9.1 U$8.5
N$17
  Top 0.406: U$8.6 J10.1
N$18
  Top 0.406: J11.1 U$8.7
N$19
  Top 0.406: J12.1 U$8.8
N$20  (via drill 0.35)
  Top 0.406: v78.61,76.07 J13.1
  Bottom 0.406: v78.61,76.07 U$8.28
N$21  (via drill 0.35)
  Top 0.406: U$8.27 v78.61,62.36
  Bottom 0.406: J14.1 74.93,66.04 v78.61,62.36
N$22
  Bottom 0.406: U$8.26 71.12,67.18 J15.1
N$23  (3 unrouted)
  Bottom 0.406: J20.8 J16.8
N$24  (3 unrouted)
  Bottom 0.406: J16.7 J20.7
N$25  (3 unrouted)
  Bottom 0.406: J20.6 J16.6
N$26  (3 unrouted)
  Bottom 0.406: J16.5 J20.5
N$27  (3 unrouted)
  Bottom 0.406: J20.4 J16.4
N$28
  Bottom 0.406: J16.3 J17.3 J18.3 J19.3 J20.3
N$29
  Bottom 0.406: J16.2 J17.2 J18.2 J19.2 J20.2
N$30
  Bottom 0.406: J16.1 J17.1 J18.1 J19.1 J20.1
N$31
  Bottom 0.406: J25.8 J24.8 J23.8 J22.8 J21.8
N$32
  Bottom 0.406: J21.7 J22.7 J23.7 J24.7 J25.7
N$33
  Bottom 0.406: J25.6 J24.6 J23.6 J22.6 J21.6
N$34
  Bottom 0.406: J21.5 J22.5 J23.5 J24.5 J25.5
N$35
  Bottom 0.406: J25.4 J24.4 J23.4 J22.4 J21.4
N$36
  Bottom 0.406: J21.3 J22.3 J23.3 J24.3 J25.3
N$37
  Bottom 0.406: J25.2 J24.2 J23.2 J22.2 J21.2
N$38
  Bottom 0.406: J21.1 J22.1 J23.1 J24.1 J25.1
RCK  (via drill 0.35)
  Top 0.406: U$11.14 27.94,12.7 v36.83,21.59
  Bottom 0.406: v36.83,21.59 36.83,29.21 U1.12
  other vias: 24.13,12.7 24.13,12.7
RRST
  Top 0.406: U1.21 45.72,41.91 44.45,40.64 44.45,24.13 38.1,24.13 29.21,15.24 U$11.12
V+  (1 unrouted)
VIN  (1 unrouted)
  Top 0.406: U$10.2 44.45,81.28 43.18,82.55 27.94,82.55 22.86,77.47 22.86,58.42 U$3.3 17.78,45.72 2.54,30.48 2.54,11.38 12.7,1.22 41.91,1.22 41.91,19.05 43.18,20.32 J27.8
  Bottom 0.406: J27.8 J27.7 J27.6 J27.5 J27.4 J27.3 J27.2 J27.1
VSY
  Top 0.406: U$11.3 21.59,26.11 20.3,27.4 20.3,27.94 20.3,28.48 22.3,30.48 25.4,30.48 27.38,32.46 27.38,33.25 27.88,33.75 38.83,33.75 U1.11
WR
  Top 0.406: U1.14 30.48,17.78 U$11.10
WRST  (via drill 0.35)
  Top 0.406: v15.24,26.67 v24.13,35.56
  Bottom 0.406: U$11.11 20.34,16.48 18.51,16.48 13.97,21.03 13.97,25.4 v15.24,26.67 | v24.13,35.56 24.13,46.99 34.29,46.99 35.56,45.72 46.99,45.72 U1.22

### Text on the board
tPlace: VIN | GND | GND | 3.3V